# Altium schematic sheet Debugging_Leds.SchDoc
size A4; SheetNumber: 11; SheetTotal: 11
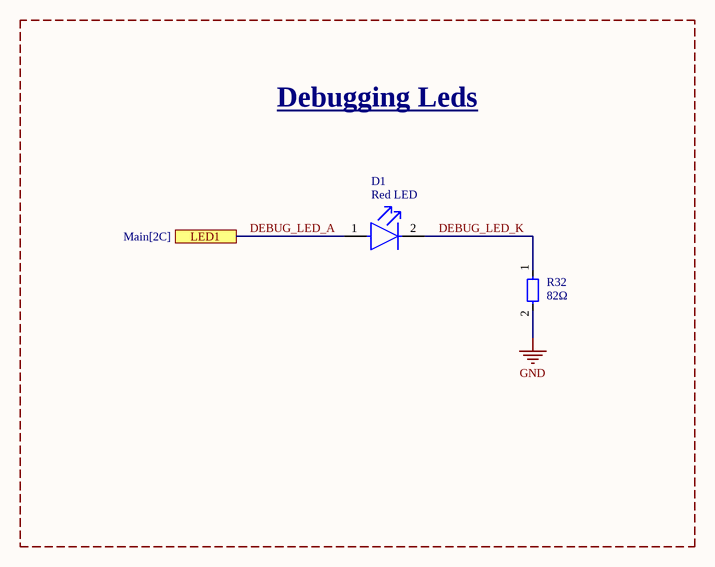
[diagram p0: Debugging_Leds.SchDoc]

## Parts
D1  Red LED  [FP-SML-LX0805SRC-TR-MFG]
R32  value 82Ω  [RES_0603]  (hidden comment: 82R)

## Blocks framed on the sheet
Debugging Leds: D1 R32

## Ports
LED1 (see Main[2C])

## Nets
GND: R32.2
DEBUG_LED_A: D1.1(A) ; port LED1
DEBUG_LED_K: D1.2(C) R32.1

## Library data of the parts
D1 = CMP-57192-000013-1: LED RED CLEAR SMD SML-LX0805SRC-TR; Forward Current: 20mA; Wavelength: 660nm; Forward Voltage: 1.7V; Luminous Intensity: 25mcd; Number of LEDs: 1; Current Rating: 25mA; Lens Color: Colorless; Power Rating: 100mW; Viewing Angle: 140°; Approvals: UL; Lens Transparency: Clear; Series: -; Package Quantity: 3000; Mount: Surface Mount; Lead Free: Lead Free; Case/Package: 0805; Max Operating Temperature: 85°C; Illumination Color: Red; Packaging: Tape and Reel; Length: 2mm; Lens Style: Clear; Width: 1.25mm; RoHS Compliant: Yes; Color: Red; Case Code (Metric): 2012; Dominant Wavelength: 660nm; Number of Pins: 2; Min Operating Temperature: -40°C; Case Code (Imperial): 0805; Voltage Rating (DC): 1.7V; Voltage Rating: 1.7V; Height: 1.2mm; Test Current: 20mA
R32 = Generic R: RES  82R 1% 0603